# EAGLE schematic Encoder (EAGLE 6.6.0)
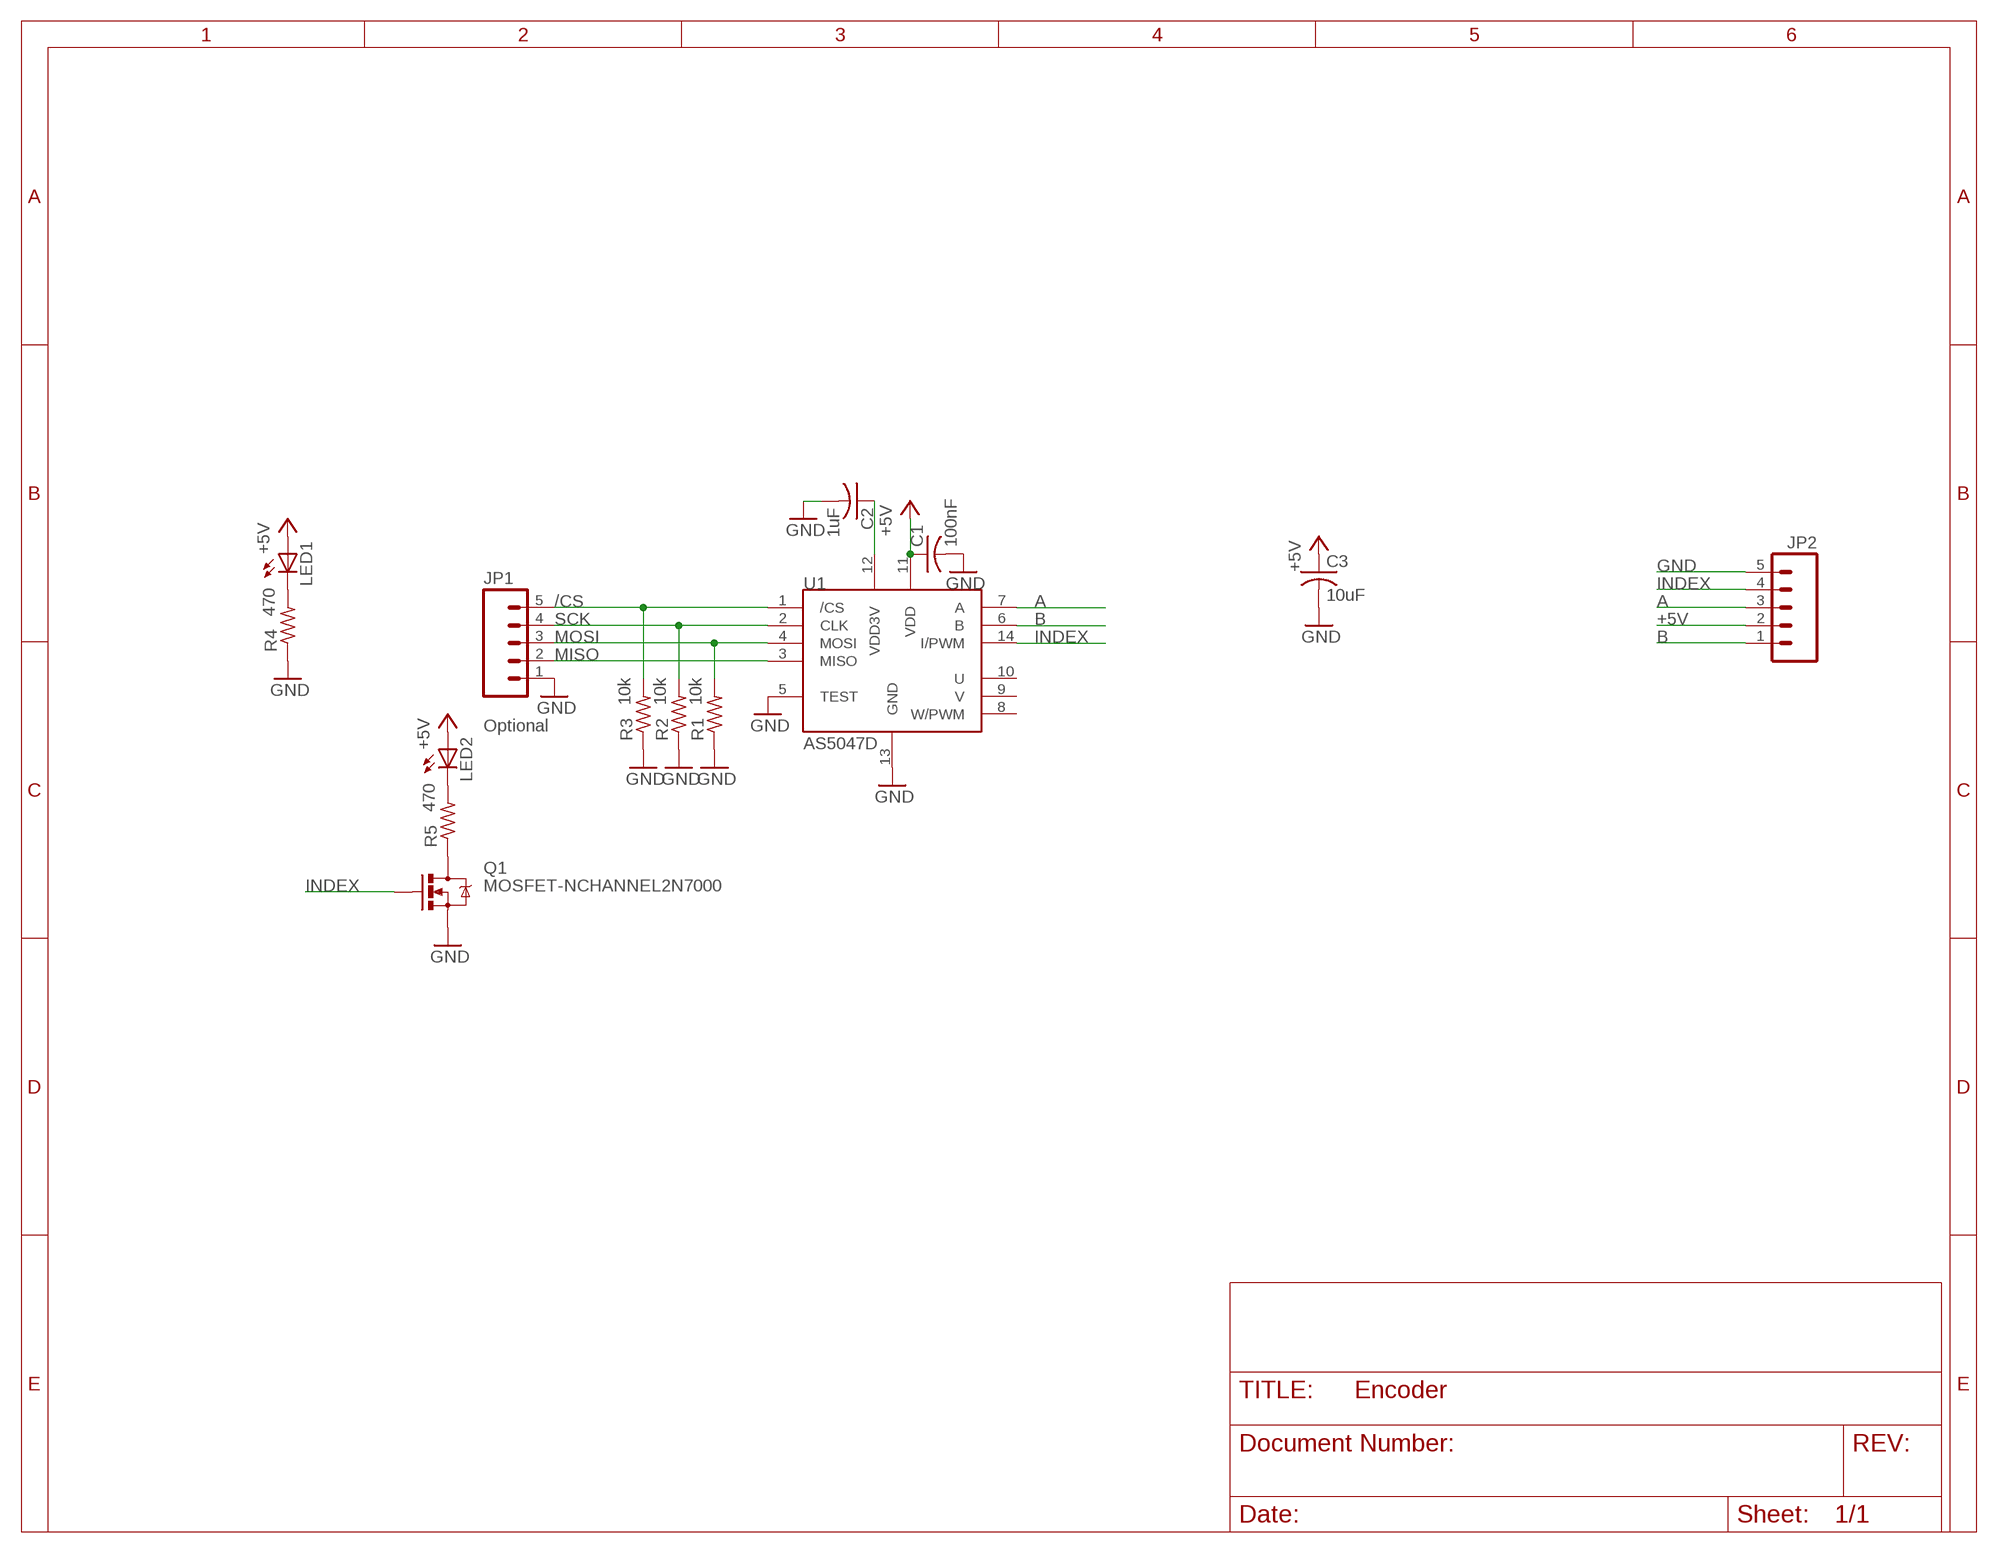
[diagram p0: schematic, sheet 1]

## Parts
C1  100nF  C-USC0603  [C0603]
C2  1uF  C-USC0603  [C0603]
C3  10uF  C-USC0603  [C0603]
JP1  M05PTH  [1X05]
JP2  M05PTH  [1X05]
LED1  LED-3MM-NO_SILK  [LED3MM-NS]
LED2  LED-3MM-NO_SILK  [LED3MM-NS]
Q1  MOSFET-NCHANNEL2N7000  [TO-92]
R1  10k  R-US_R0603  [R0603]
R2  10k  R-US_R0603  [R0603]
R3  10k  R-US_R0603  [R0603]
R4  470  R-US_R0603  [R0603]
R5  470  R-US_R0603  [R0603]
U1  AS5047D  [TSSOP14]

## Nets
+5V: C1.1 C3.1 JP2.2 LED1.A LED2.A U1.11(VDD)
/CS: JP1.5 R3.2 U1.1(/CS)
A: JP2.3 U1.7(A)
B: JP2.1 U1.6(B)
GND: C1.2 C2.2 C3.2 JP1.1 JP2.5 Q1.1(S) R1.1 R2.1 R3.1 R4.1 U1.5(TEST) U1.13(GND)
INDEX: JP2.4 Q1.2(G) U1.14(I/PWM)
MISO: JP1.2 U1.3(MISO)
MOSI: JP1.3 R1.2 U1.4(MOSI)
N$1: C2.1 U1.12(VDD3V)
N$2: LED1.K(C) R4.2
N$3: Q1.3(D) R5.1
N$4: LED2.K(C) R5.2
SCK: JP1.4 R2.2 U1.2(CLK)
Unconnected: U1.8(W/PWM) U1.9(V) U1.10(U)

## Notes on the sheet
- Optional

## Library data of the parts
C1-C3 = rcl:C-US: CAPACITOR, American symbol
JP1 JP2 = SparkFun-Connectors:M05: Header 5 Standard 5-pin 0.1" header. Use with straight break away headers (SKU : PRT-00116), right angle break away headers (PRT-00553), swiss pins (PRT-00743), machine pins (PRT-00117), and female headers (PRT-00115). Molex polarized connector foot print use with SKU : PRT-08230 with associated crimp pins and housings.
LED1 LED2 = SparkFun-LED:LED: LEDs Standard schematic elements and footprints for 5mm, 3mm, 1206, and 0603 sized LEDs. 5mm - Spark Fun Electronics SKU : COM-00529 (and others)
Q1 = SparkFun-DiscreteSemi:MOSFET-NCHANNEL: Common NMOSFET Parts MFG P/N Store ID Prod ID FDD8780 TRANS-09984 SI7820DN TRANS-11055 FDS6630A IC-08089 2N7002PW TRANS-11151 FQP30N06L COM-10213 TRANS-10060 BSS123LT1G TRANS-08345 BSS138 TRANS-00830 BS170 2N7000
R1-R5 = rcl:R-US_: RESISTOR, American symbol
U1 = npol-analog:AS5047D